# EAGLE schematic carcomputer_split3_top (EAGLE 9.3.2)
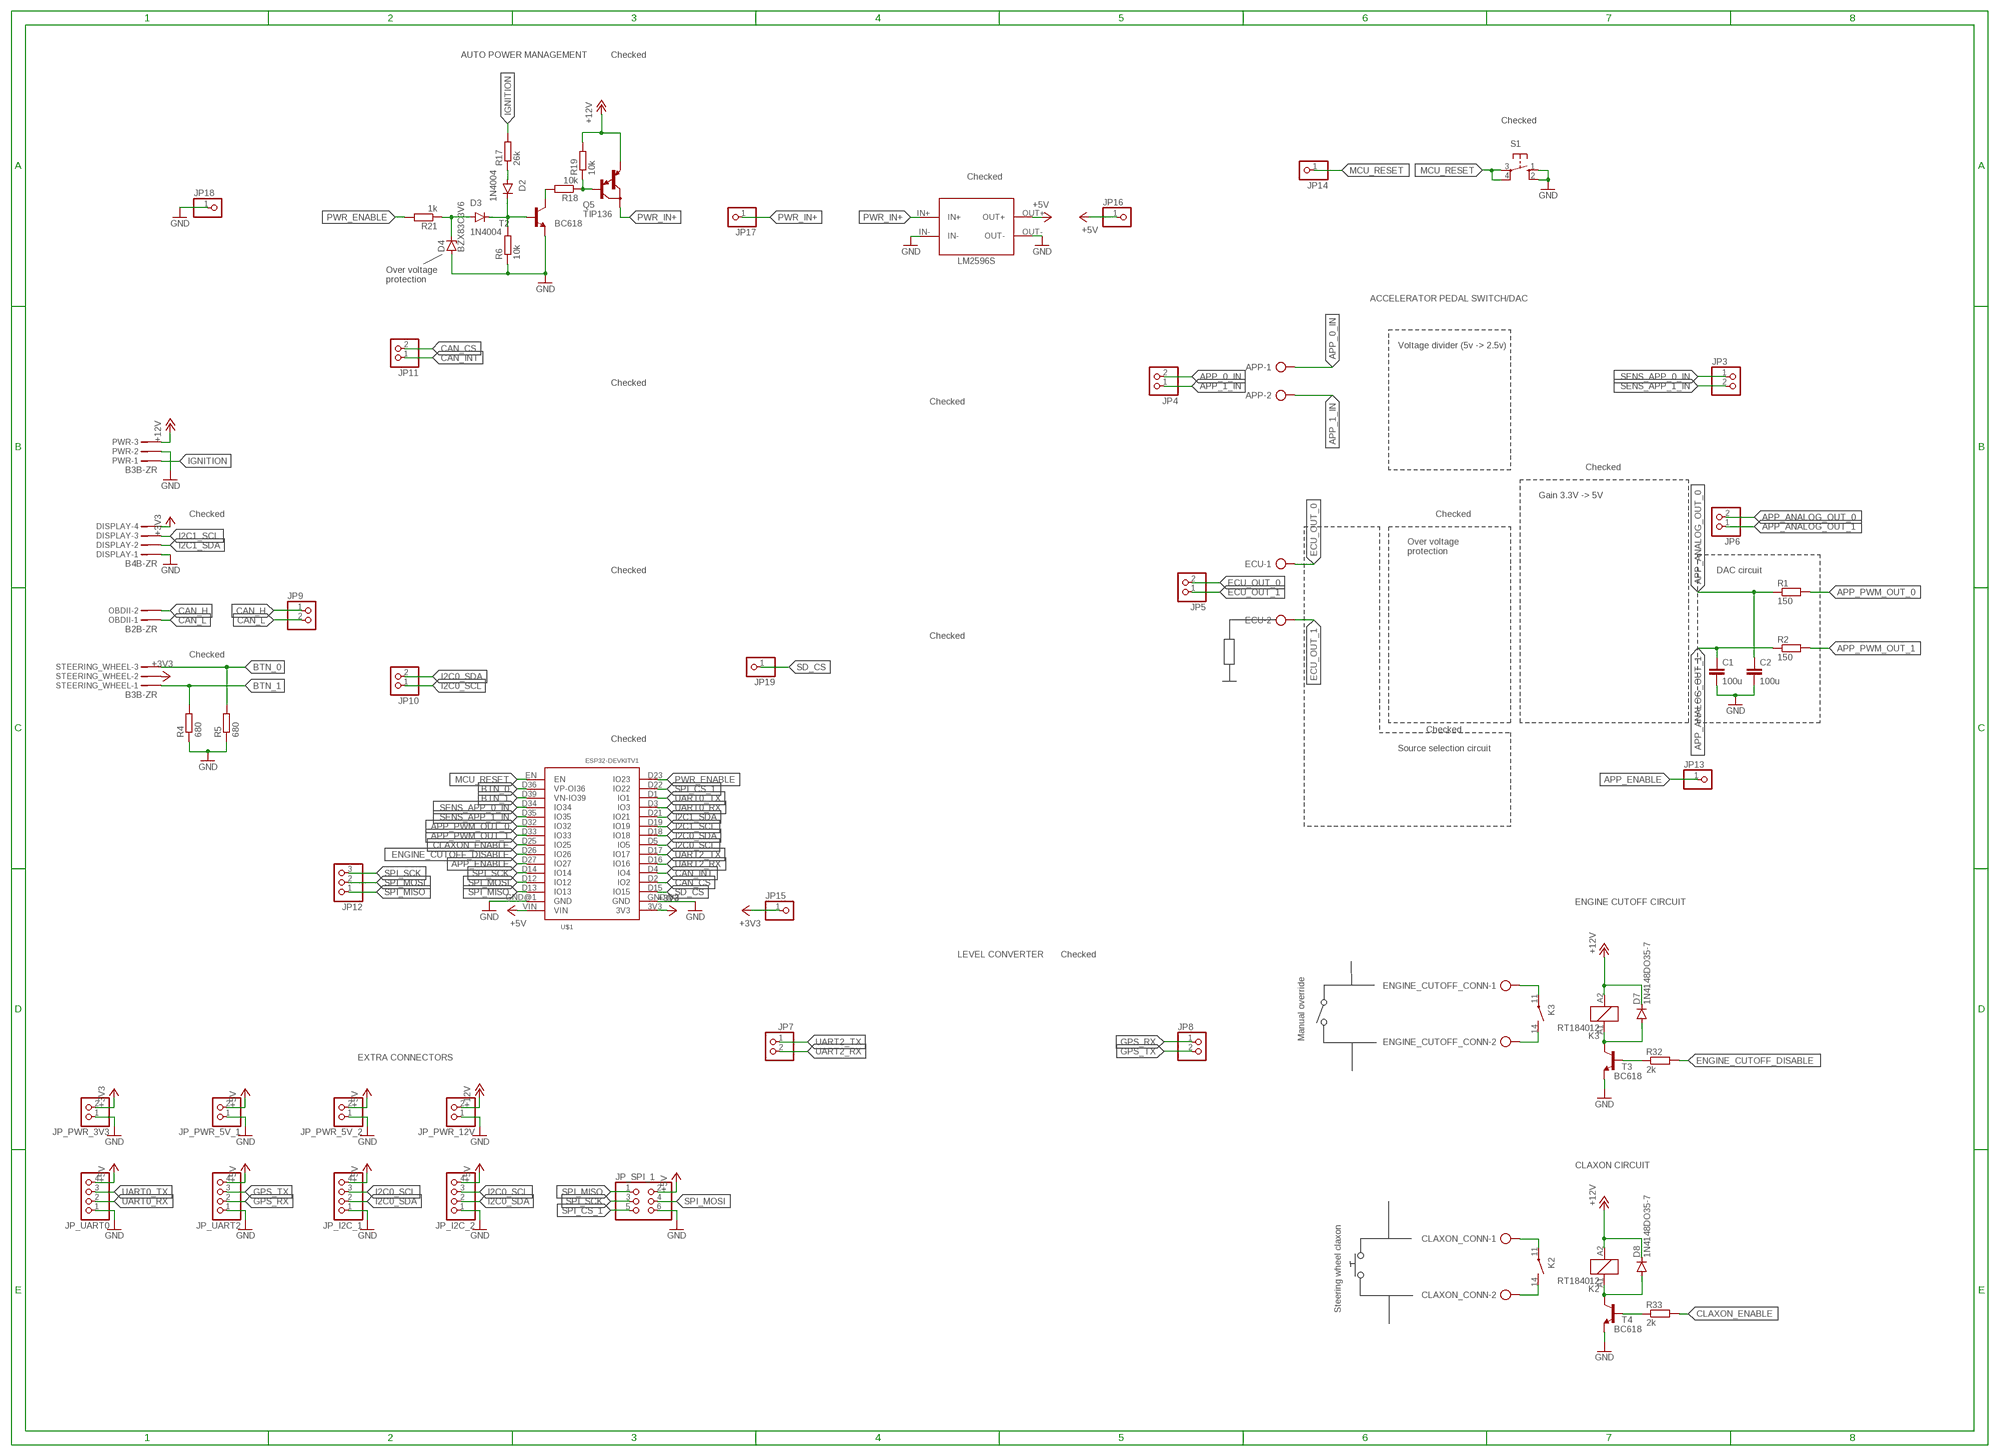
[diagram p0: schematic, sheet 1]

## Parts
APP  AK300/2  [AK300/2]
C1  100u  C-EU025-050X050  [C025-050X050]
C2  100u  C-EU025-050X050  [C025-050X050]
CLAXON_CONN  AK300/2  [AK300/2]
D2  1N4004  [DO41-10]
D3  1N4004  [DO41-10]
D4  BZX83C3V6  BZX85  [DO41Z10]
D7  1N4148DO35-7  [DO35-7]
D8  1N4148DO35-7  [DO35-7]
DISPLAY  B4B-ZR  [B4B-ZR]
ECU  AK300/2  [AK300/2]
ENGINE_CUTOFF_CONN  AK300/2  [AK300/2]
JP3  PINHD-1X2  [1X02]
JP4  PINHD-1X2  [1X02]
JP5  PINHD-1X2  [1X02]
JP6  PINHD-1X2  [1X02]
JP7  PINHD-1X2  [1X02]
JP8  PINHD-1X2  [1X02]
JP9  PINHD-1X2  [1X02]
JP10  PINHD-1X2  [1X02]
JP11  PINHD-1X2  [1X02]
JP12  PINHD-1X3  [1X03]
JP13  PINHD-1X1  [1X01]
JP14  PINHD-1X1  [1X01]
JP15  PINHD-1X1  [1X01]
JP16  PINHD-1X1  [1X01]
JP17  PINHD-1X1  [1X01]
JP18  PINHD-1X1  [1X01]
JP19  PINHD-1X1  [1X01]
JP_I2C_1  PINHD-1X4  [1X04]
JP_I2C_2  PINHD-1X4  [1X04]
JP_PWR_3V3  PINHD-1X2  [1X02]
JP_PWR_5V_1  PINHD-1X2  [1X02]
JP_PWR_5V_2  PINHD-1X2  [1X02]
JP_PWR_12V  PINHD-1X2  [1X02]
JP_SPI_1  PINHD-2X3  [2X03]
JP_UART0  PINHD-1X4  [1X04]
JP_UART2  PINHD-1X4  [1X04]
K2  RT184012  [RT-N/O12A3.5]
K3  RT184012  [RT-N/O12A3.5]
OBDII  B2B-ZR  [B2B-ZR]
PWR  B3B-ZR  [B3B-ZR]
Q5  TIP136  [TO220]
R1  150  R-EU_0207/7  [0207/7]
R2  150  R-EU_0207/7  [0207/7]
R4  680  R-EU_0207/7  [0207/7]
R5  680  R-EU_0207/7  [0207/7]
R6  10k  R-EU_0207/7  [0207/7]
R17  26k  R-EU_0207/7  [0207/7]
R18  10k  R-EU_0207/7  [0207/7]
R19  10k  R-EU_0207/7  [0207/7]
R21  1k  R-EU_0207/7  [0207/7]
R32  2k  R-EU_0207/7  [0207/7]
R33  2k  R-EU_0207/7  [0207/7]
S1  10-XX  [B3F-10XX]
STEERING_WHEEL  B3B-ZR  [B3B-ZR]
T2  BC618  [TO92-EBC]
T3  BC618  [TO92-EBC]
T4  BC618  [TO92-EBC]
U$1  ESP32DEVKITV1  [ESP32-DEVKITV1]
U$4  LM2596S  [LM2596S]

## Nets
+3V3: DISPLAY.4 JP15.1 JP_PWR_3V3.2 STEERING_WHEEL.2 U$1.3V3
+5V: JP16.1 JP_I2C_1.4 JP_I2C_2.4 JP_PWR_5V_1.2 JP_PWR_5V_2.2 JP_SPI_1.2 JP_UART0.4 JP_UART2.4 U$1.VIN U$4.OUT+
+12V: D7.C D8.C JP_PWR_12V.2 K2.A2 K3.A2 PWR.3 Q5.3(E) R19.2
APP_0_IN: APP.1 JP4.2
APP_1_IN: APP.2 JP4.1
APP_ANALOG_OUT_0: C2.1 JP6.2 R1.1
APP_ANALOG_OUT_1: C1.1 JP6.1 R2.1
APP_ENABLE: JP13.1 U$1.D27(IO27)
APP_PWM_OUT_0: R1.2 U$1.D32(IO32)
APP_PWM_OUT_1: R2.2 U$1.D33(IO33)
BTN_0: R5.2 STEERING_WHEEL.3 U$1.D36(VP-OI36)
BTN_1: R4.2 STEERING_WHEEL.1 U$1.D39(VN-IO39)
CAN_CS: JP11.2 U$1.D2(IO2)
CAN_H: JP9.1 OBDII.2
CAN_INT: JP11.1 U$1.D4(IO4)
CAN_L: JP9.2 OBDII.1
CLAXON_ENABLE: R33.2 U$1.D25(IO25)
ECU_OUT_0: ECU.1 JP5.2
ECU_OUT_1: ECU.2 JP5.1
ENGINE_CUTOFF_DISABLE: R32.2 U$1.D26(IO26)
GND: C1.2 C2.2 D4.A DISPLAY.1 JP18.1 JP_I2C_1.1 JP_I2C_2.1 JP_PWR_3V3.1 JP_PWR_5V_1.1 JP_PWR_5V_2.1 JP_PWR_12V.1 JP_SPI_1.6 JP_UART0.1 JP_UART2.1 PWR.2 R4.1 R5.1 R6.1 S1.1(S) S1.2(S1) T2.E T3.E T4.E U$1.GND@1(GND) U$1.GND@2(GND) U$4.IN- U$4.OUT-
GPS_RX: JP8.1 JP_UART2.2
GPS_TX: JP8.2 JP_UART2.3
I2C0_SCL: JP10.1 JP_I2C_1.3 JP_I2C_2.3 U$1.D5(IO5)
I2C0_SDA: JP10.2 JP_I2C_1.2 JP_I2C_2.2 U$1.D18(IO18)
I2C1_SCL: DISPLAY.3 U$1.D19(IO19)
I2C1_SDA: DISPLAY.2 U$1.D21(IO21)
IGNITION: PWR.1 R17.2
MCU_RESET: JP14.1 S1.3(P) S1.4(P1) U$1.EN
N$5: D2.C D3.C R6.2 T2.B
N$11: D3.A D4.C R21.1
N$12: D2.A R17.1
N$14: Q5.1(B) R18.1 R19.1
N$15: R18.2 T2.C
N$19: ENGINE_CUTOFF_CONN.1 K3.11(2:P)
N$20: ENGINE_CUTOFF_CONN.2 K3.14(2:S)
N$22: D7.A K3.A1 T3.C
N$23: D8.A K2.A1 T4.C
N$25: R33.1 T4.B
N$26: R32.1 T3.B
N$27: CLAXON_CONN.1 K2.11(2:P)
N$28: CLAXON_CONN.2 K2.14(2:S)
PWR_ENABLE: R21.2 U$1.D23(IO23)
PWR_IN+: JP17.1 Q5.2(C) U$4.IN+
SD_CS: JP19.1 U$1.D15(IO15)
SENS_APP_0_IN: JP3.1 U$1.D34(IO34)
SENS_APP_1_IN: JP3.2 U$1.D35(IO35)
SPI_CS_1: JP_SPI_1.5 U$1.D22(IO22)
SPI_MISO: JP12.1 JP_SPI_1.1 U$1.D13(IO13)
SPI_MOSI: JP12.2 JP_SPI_1.4 U$1.D12(IO12)
SPI_SCK: JP12.3 JP_SPI_1.3 U$1.D14(IO14)
UART0_RX: JP_UART0.2 U$1.D3(IO3)
UART0_TX: JP_UART0.3 U$1.D1(IO1)
UART2_RX: JP7.2 U$1.D16(IO16)
UART2_TX: JP7.1 U$1.D17(IO17)

## Notes on the sheet
- AUTO POWER MANAGEMENT | Checked
- Checked
- Checked
- Over voltage
  protection
- ACCELERATOR PEDAL SWITCH/DAC
- Voltage divider (5v -> 2.5v)
- Checked
- Checked
- Checked
- Gain 3.3V -> 5V
- Checked | Checked
- Over voltage
  protection
- Checked | DAC circuit
- Checked
- Checked
- Checked
- Checked
- Source selection circuit
- ENGINE CUTOFF CIRCUIT
- LEVEL CONVERTER | Checked
- Manual override
- EXTRA CONNECTORS
- CLAXON CIRCUIT
- Steering wheel claxon

## Library data of the parts
APP CLAXON_CONN ECU ENGINE_CUTOFF_CONN = con-ptr500-custom:AK300/2: CONNECTOR; OC_FARNELL: unknown; OC_NEWARK: unknown
C1 C2 = rcl:C-EU: CAPACITOR, European symbol; SPICEPREFIX: C
D2 D3 = diode:1N4004: DIODE general purpose rectifier, 1 A
D4 = diode:BZX85: Z DIODE
D7 D8 = diode:1N4148: DIODE high speed (Philips)
DISPLAY = con-jst-custom:?4B-ZR: ZH CONNECTOR 1.5 mm, 4 pin 1 row Source: http://www.jst.com .. eZH.pdf; MF: FARNELL; MPN: B4B-ZR(LF)(SN); OC_FARNELL: 1830916; OC_NEWARK: 37K9960
JP3-JP11 JP_PWR_3V3 JP_PWR_5V_1 JP_PWR_5V_2 JP_PWR_12V = pinhead:PINHD-1X2: PIN HEADER
JP12 = pinhead:PINHD-1X3: PIN HEADER
JP13-JP19 = pinhead:PINHD-1X1: PIN HEADER
JP_I2C_1 JP_I2C_2 JP_UART0 JP_UART2 = pinhead:PINHD-1X4: PIN HEADER
JP_SPI_1 = pinhead:PINHD-2X3: PIN HEADER
K2 K3 = relay:RT?*: Power PCB Relay SCHRACK 1 pole 12 / 16 A, DC- or AC-coil Source: http://www.schrack.com/.. 5819.pdf; MF: TYCO ELECTRONICS; MPN: RT184012; OC_FARNELL: unknown; OC_NEWARK: 08H3731
OBDII = con-jst-custom:?2B-ZR: ZH CONNECTOR 1.5 mm, 4 pin 1 row Source: http://www.jst.com .. eZH.pdf
PWR STEERING_WHEEL = con-jst-custom:?3B-ZR: ZH CONNECTOR 1.5 mm, 4 pin 1 row Source: http://www.jst.com .. eZH.pdf
Q5 = transistor-pnp:TIP136: PNP Darlington Transistor
R1 R2 R4-R6 R17-R19 R21 R32 R33 = rcl:R-EU_: RESISTOR, European symbol; SPICEPREFIX: R
S1 = switch-omron:10-XX: OMRON SWITCH; MPN: B3F-1000; OC_FARNELL: 176432; OC_NEWARK: 36M3542
T2-T4 = transistor-npn:BC618*: NPN Transistor
U$1 = ESP32-DEVKITV1:ESP32DEVKITV1
U$4 = PSU:LM2596S